# EAGLE design ioboard (EAGLE 9.6.2)
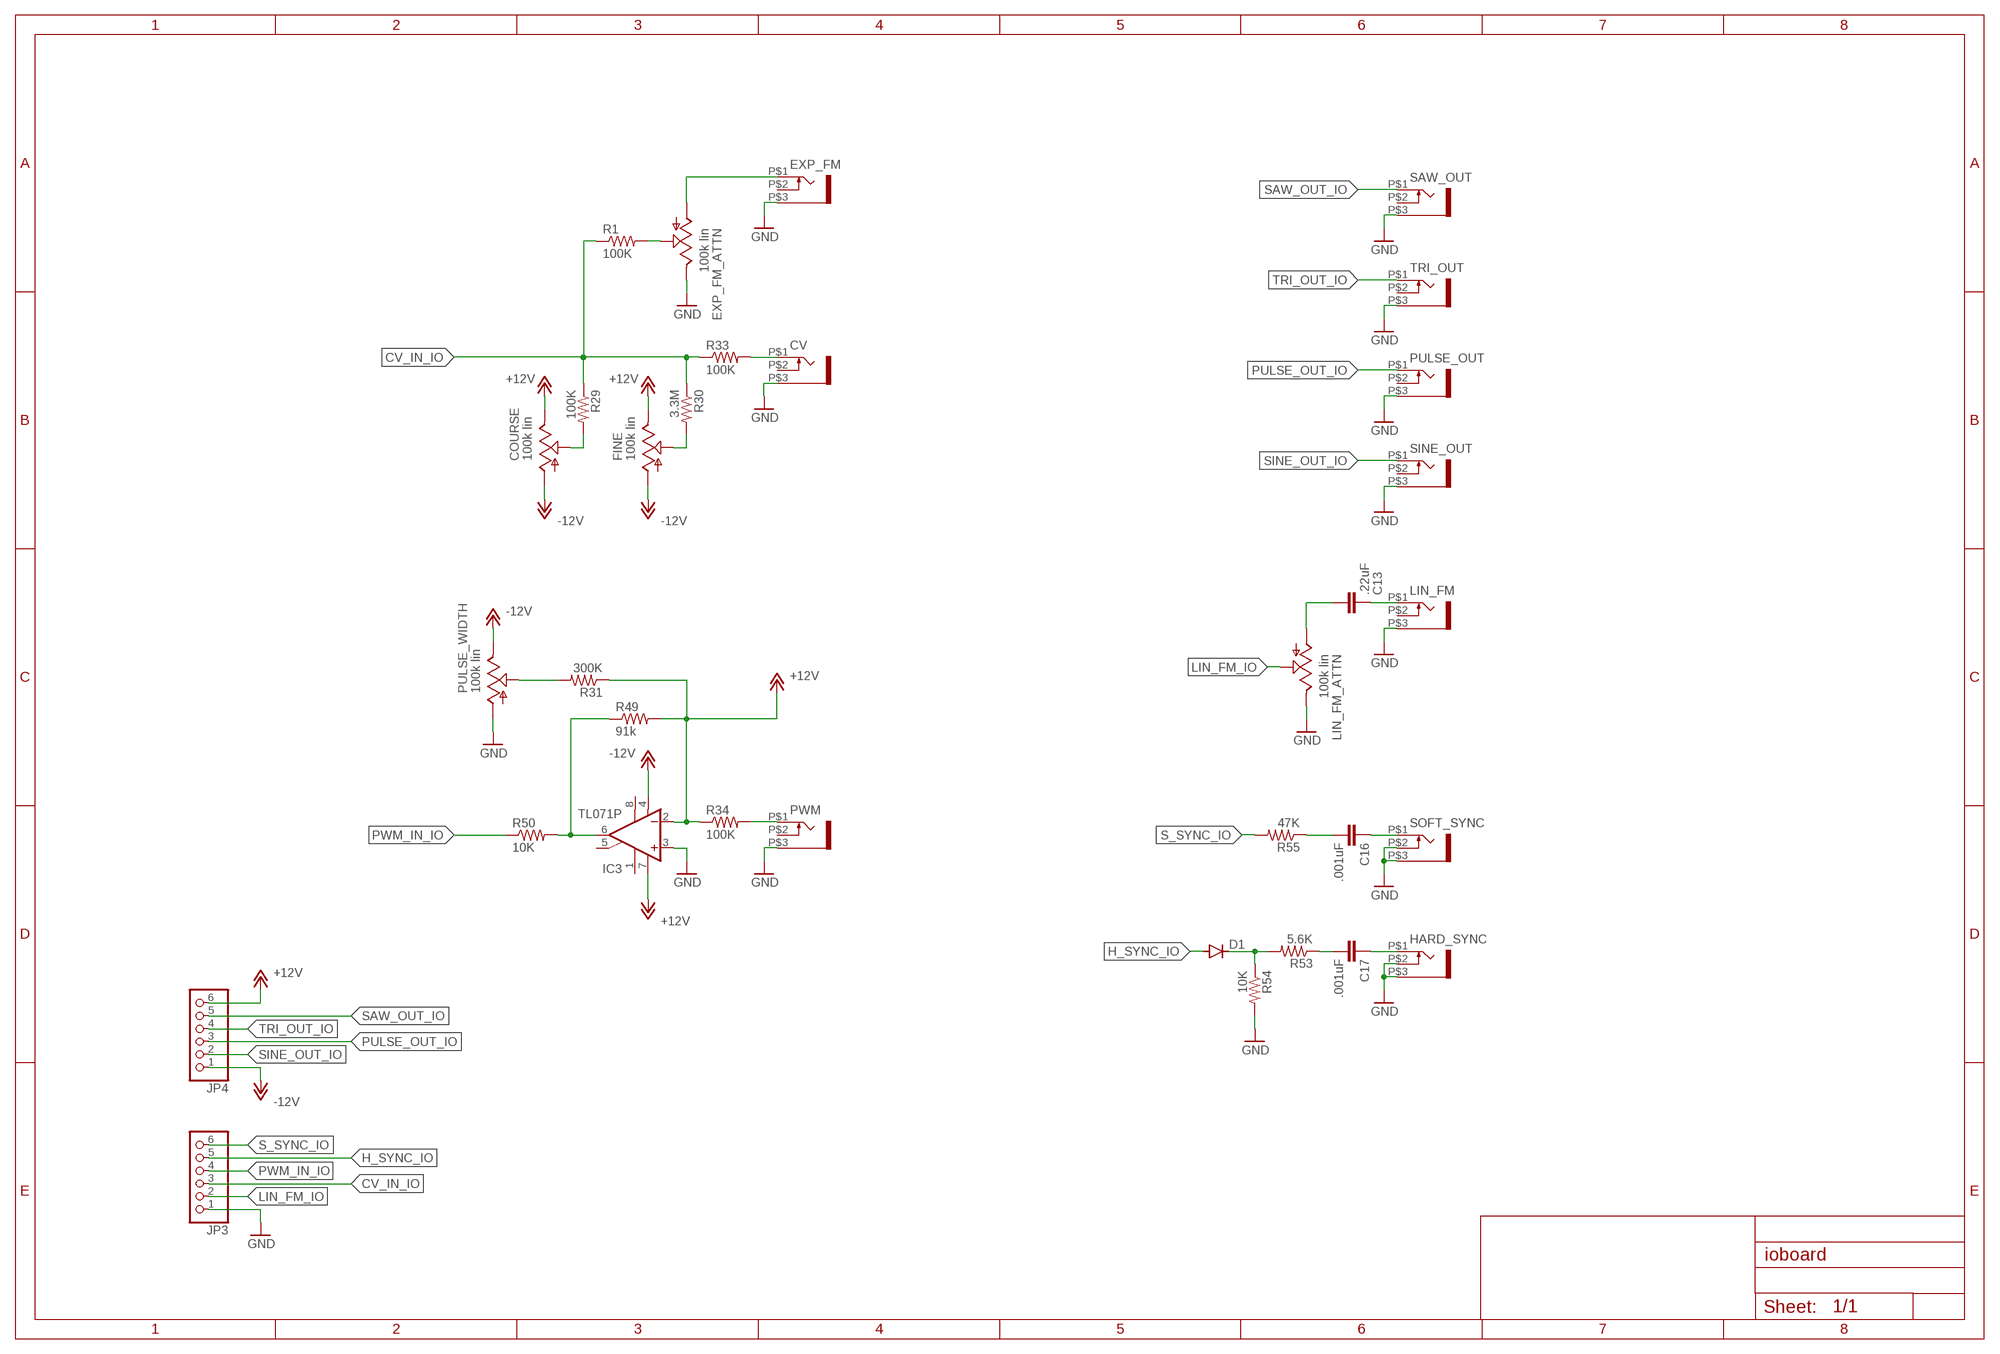
[diagram p0: schematic, sheet 1]

## Parts
C13  .22uF  C-EU050-024X044  [C050-024X044]
C16  .001uF  C-EU050-024X044  [C050-024X044]
C17  .001uF  C-EU050-024X044  [C050-024X044]
COURSE  100k lin  ALPHA-9MMA  [EVUF]
CV  WQP-PJ301M-12_JACK  [WQP-PJ301M-12_JACK]
D1  1N4148DO35-7  [DO35-7]
EXP_FM  WQP-PJ301M-12_JACK  [WQP-PJ301M-12_JACK]
EXP_FM_ATTN  100k lin  ALPHA-9MMA  [EVUF]
FINE  100k lin  ALPHA-9MMA  [EVUF]
HARD_SYNC  WQP-PJ301M-12_JACK  [WQP-PJ301M-12_JACK]
IC3  TL071P  [DIL08]
JP3  PINHD-1X6  [1X06]
JP4  PINHD-1X6  [1X06]
LIN_FM  WQP-PJ301M-12_JACK  [WQP-PJ301M-12_JACK]
LIN_FM_ATTN  100k lin  ALPHA-9MMA  [EVUF]
PULSE_OUT  WQP-PJ301M-12_JACK  [WQP-PJ301M-12_JACK]
PULSE_WIDTH  100k lin  ALPHA-9MMA  [EVUF]
PWM  WQP-PJ301M-12_JACK  [WQP-PJ301M-12_JACK]
R1  100K  R-US_0207/7  [0207/7]
R29  100K  R-US_0207/7  [0207/7]
R30  3.3M  R-US_0207/7  [0207/7]
R31  300K  R-US_0207/7  [0207/7]
R33  100K  R-US_0207/7  [0207/7]
R34  100K  R-US_0207/7  [0207/7]
R49  91k  R-US_0207/7  [0207/7]
R50  10K  R-US_0207/7  [0207/7]
R53  5.6K  R-US_0207/7  [0207/7]
R54  10K  R-US_0207/7  [0207/7]
R55  47K  R-US_0207/7  [0207/7]
SAW_OUT  WQP-PJ301M-12_JACK  [WQP-PJ301M-12_JACK]
SINE_OUT  WQP-PJ301M-12_JACK  [WQP-PJ301M-12_JACK]
SOFT_SYNC  WQP-PJ301M-12_JACK  [WQP-PJ301M-12_JACK]
TRI_OUT  WQP-PJ301M-12_JACK  [WQP-PJ301M-12_JACK]

## Nets
+12V: COURSE.3(E) FINE.3(E) IC3.2(-IN) IC3.7(V+) JP4.6 R31.1 R34.1 R49.2
-12V: COURSE.1(A) FINE.1(A) IC3.4(V-) JP4.1 PULSE_WIDTH.3(E)
CV_IN_IO: JP3.3 R1.1 R29.1 R30.1 R33.1
GND: CV.P$3 EXP_FM.P$3 EXP_FM_ATTN.3(E) HARD_SYNC.P$2 HARD_SYNC.P$3 IC3.3(+IN) JP3.1 LIN_FM.P$3 LIN_FM_ATTN.3(E) PULSE_OUT.P$3 PULSE_WIDTH.1(A) PWM.P$3 R54.2 SAW_OUT.P$3 SINE_OUT.P$3 SOFT_SYNC.P$2 SOFT_SYNC.P$3 TRI_OUT.P$3
H_SYNC_IO: D1.A JP3.5
LIN_FM_IO: EXP_FM_ATTN.2(S) JP3.2 LIN_FM_ATTN.2(S) R1.2
N$1: EXP_FM.P$1 EXP_FM_ATTN.1(A)
N$25: COURSE.2(S) R29.2
N$26: FINE.2(S) R30.2
N$27: CV.P$1 R33.2
N$35: PWM.P$1 R34.2
N$37: PULSE_WIDTH.2(S) R31.2
N$41: C13.2 LIN_FM.P$1
N$42: C13.1 LIN_FM_ATTN.1(A)
N$43: C16.1 SOFT_SYNC.P$1
N$44: IC3.6(OUT) R49.1 R50.2
N$45: C16.2 R55.1
N$46: C17.1 HARD_SYNC.P$1
N$47: C17.2 R53.1
N$48: D1.C R53.2 R54.1
PULSE_OUT_IO: JP4.3 PULSE_OUT.P$1
PWM_IN_IO: JP3.4 R50.1
S_SYNC_IO: JP3.6 R55.2
SAW_OUT_IO: JP4.5 SAW_OUT.P$1
SINE_OUT_IO: JP4.2 SINE_OUT.P$1
TRI_OUT_IO: JP4.4 TRI_OUT.P$1
Unconnected: CV.P$2 EXP_FM.P$2 IC3.1(ON1) IC3.5(ON2) IC3.8(OPT) LIN_FM.P$2 PULSE_OUT.P$2 PWM.P$2 SAW_OUT.P$2 SINE_OUT.P$2 TRI_OUT.P$2

## Library data of the parts
C13 C16 C17 = resistor:C-EU: CAPACITOR, European symbol
COURSE EXP_FM_ATTN FINE LIN_FM_ATTN PULSE_WIDTH = TomW:ALPHA-9MM: 9 mm Square Rotary Potentiometers Source: Panasonic
CV EXP_FM HARD_SYNC LIN_FM PULSE_OUT PWM SAW_OUT SINE_OUT SOFT_SYNC TRI_OUT = thonkiconn:WQP-PJ301M-12_JACK
D1 = diode:1N4148: DIODE high speed (Philips)
IC3 = linear:TL071: OP AMP
JP3 JP4 = pinhead:PINHD-1X6: PIN HEADER
R1 R29-R31 R33 R34 R49 R50 R53-R55 = resistor:R-US_: RESISTOR, American symbol

## Board
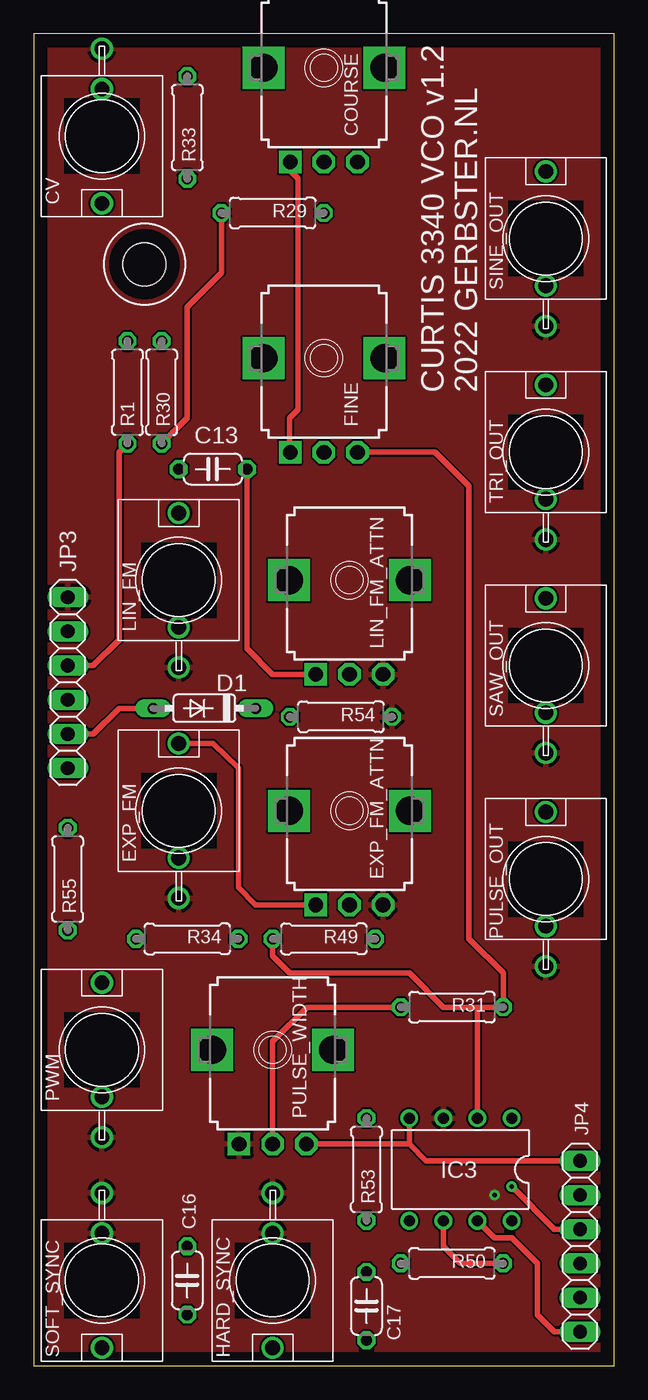
[diagram p1: board, top side]
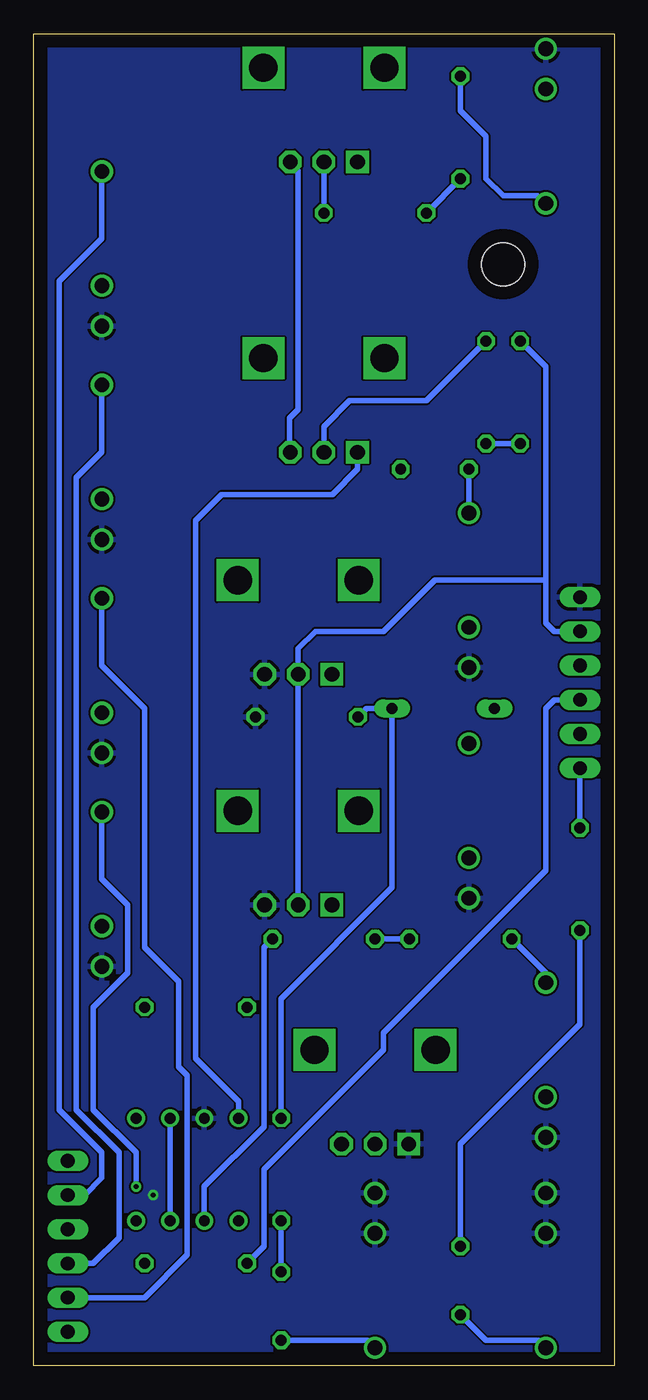
[diagram p2: board, bottom side, seen from below]

Size 43.18 x 99.06 mm. Coordinates in mm from the lower left corner, seen from the top.
Outline: 43.18,0 43.18,99.06 0,99.06 0,0 43.18,0
Copper layers (1*16): Top 0.035mm / dielectric 1.5mm / Bottom 0.035mm
Design rules "default": minimum track width 6mil, minimum drill 0.35mm, track to track 6mil, track to pad 6mil, pad to pad 6mil, via to via 6mil, smd to smd 6mil, copper to edge 40mil, drill to drill 6mil, minimum pad ring 10mil, minimum via ring 8mil, stop-mask expansion 4mil, vias tented up to drill 0mil, thermal gap 10mil
Holes 3.2 mm at 8.26,81.92

### Footprints (pad centres in the part's own frame; a part is rotated, then mirrored left to right if it is on the bottom)
C050-024X044 = drill 0.813 octagon: 1 -2.54,0; 2 2.54,0
EVUF = drill 1.1 pad 1.676 square: 1 -2.5,-7 | drill 1.1 pad 1.676 octagon: 2 0,-7; 3 2.5,-7 | drill 2.1 pad 2.8 square: M1 4.5,0; M2 -4.5,0
WQP-PJ301M-12_JACK = drill 1.1: P$1 0,5; P$2 0,-3.5; P$3 0,-6.5
DO35-7 = drill 0.813 long: A 3.81,0; C -3.81,0
DIL08 = drill 0.813 pad 1.27: 1 -3.81,-3.81; 2 -1.27,-3.81; 3 1.27,-3.81; 4 3.81,-3.81; 5 3.81,3.81; 6 1.27,3.81; 7 -1.27,3.81; 8 -3.81,3.81
1X06 = drill 1.016 long: 1 -6.35,0; 2 -3.81,0; 3 -1.27,0; 4 1.27,0; 5 3.81,0; 6 6.35,0
0207/7 = drill 0.813 octagon: 1 -3.81,0; 2 3.81,0

### Placement (x,y rotation side)
C13  13.34,66.67 180 top
C16  11.43,6.35 90 top
C17  24.77,4.45 90 top
COURSE  21.59,96.52 0 top
CV  5.08,91.44 180 top
D1  12.7,48.9 180 top
EXP_FM  10.79,41.27 0 top
EXP_FM_ATTN  23.5,41.27 0 top
FINE  21.59,74.93 0 top
HARD_SYNC  17.78,6.35 180 top
IC3  31.75,14.61 180 top
JP3  2.54,50.8 270 top
JP4  40.64,8.89 270 top
LIN_FM  10.79,58.42 0 top
LIN_FM_ATTN  23.5,58.42 0 top
PULSE_OUT  38.1,36.2 0 top
PULSE_WIDTH  17.78,23.5 0 top
PWM  5.08,23.5 0 top
R1  6.99,72.39 90 top
R29  17.78,85.72 0 top
R30  9.53,72.39 90 top
R31  31.11,26.67 180 top
R33  11.43,92.08 90 top
R34  11.43,31.75 180 top
R49  21.59,31.75 180 top
R50  31.11,7.62 0 top
R53  24.77,14.61 90 top
R54  22.86,48.26 0 top
R55  2.54,36.2 90 top
SAW_OUT  38.1,52.07 0 top
SINE_OUT  38.1,83.82 0 top
SOFT_SYNC  5.08,6.35 180 top
TRI_OUT  38.1,67.94 0 top

### Tracks (layer width: path | path; a pad name or v marks a point on that pad's centre or on a via)
+12V  (via drill 0.35)
  Top 0.406: IC3.7 34.29,9.53 35.56,9.53 37.47,7.62 37.47,3.81 38.73,2.54 JP4.6 | FINE.3 v24.13,67.93 v24.13,67.94 29.84,67.94 32.38,65.41 32.38,31.75 34.92,29.21 R31.1 33.02,26.67 | 33.02,26.67 30.48,26.67 27.94,29.21 19.05,29.21 17.78,30.48 R49.2 | IC3.2 33.02,26.67
  Bottom 0.406: IC3.7 IC3.2 | COURSE.3 23.5,88.89 23.5,71.12 24.13,70.48 v24.13,67.94 | R49.2 R34.1
-12V
  Top 0.406: 27.94,16.51 PULSE_WIDTH.3 | IC3.4 27.94,16.51 | COURSE.1 19.09,88.9 19.05,88.9 19.68,88.27 19.68,71.12 19.05,70.48 19.05,67.93 FINE.1 | JP4.1 29.17,15.24 27.94,16.51
  Bottom 0.406: FINE.1 19.09,66.67 20.95,64.77 29.21,64.77 31.11,62.87 31.11,22.86 27.94,19.68 IC3.4
CV_IN_IO
  Top 0.406: R30.1 11.43,70.48 11.43,78.74 13.97,81.28 R29.1 | JP3.3 4.45,52.07 6.35,53.98 6.35,67.94 R1.1
  Bottom 0.406: R33.1 R29.1 | R1.1 R30.1
GND  (via drill 0.35)
  other vias: 34.29,12.7
  pour Top: 0,0 43.18,0 43.18,99.06 0,99.06
  pour Bottom: 0,0 43.18,0 43.18,99.06 0,99.06
H_SYNC_IO
  Top 0.406: JP3.5 4.45,46.99 6.35,48.9 D1.A
LIN_FM_IO
  Bottom 0.406: 5.08,58.42 5.08,55.24 4.45,54.61 JP3.2 | 5.08,58.42 5.08,74.3 R1.2 | EXP_FM_ATTN.2 LIN_FM_ATTN.2 23.5,53.34 22.23,54.61 17.14,54.61 13.34,58.42 5.08,58.42
N$1
  Top 0.406: EXP_FM.P$1 13.34,46.27 15.24,44.45 15.24,35.56 16.51,34.29 21.63,34.29 EXP_FM_ATTN.1
N$25
  Bottom 0.406: COURSE.2 R29.2
N$26
  Bottom 0.406: FINE.2 21.59,69.85 19.68,71.75 13.97,71.75 R30.2
N$27
  Bottom 0.406: R33.2 11.43,93.34 9.53,91.44 9.53,88.27 8.26,87 5.71,87 CV.P$1
N$35
  Bottom 0.406: PWM.P$1 5.08,29.21 R34.2
N$37
  Top 0.406: R31.2 20.32,26.67 17.78,24.13 PULSE_WIDTH.2
N$41
  Bottom 0.406: LIN_FM.P$1 C13.2
N$42
  Top 0.406: C13.1 15.88,53.34 17.78,51.42 LIN_FM_ATTN.1
N$43
  Bottom 0.406: SOFT_SYNC.P$1 5.63,1.91 9.53,1.91 C16.1
N$44
  Top 0.406: IC3.6 30.48,8.89 31.75,7.62 R50.2
  Bottom 0.406: R49.1 26.04,31.11 26.04,17.78 30.48,13.34 IC3.6
N$45
  Bottom 0.406: C16.2 11.43,16.51 2.54,25.4 R55.1
N$46
  Bottom 0.406: HARD_SYNC.P$1 18.34,1.91 C17.1
N$47
  Bottom 0.406: R53.1 C17.2
N$48
  Bottom 0.406: R54.1 18.41,48.9 D1.C 16.51,35.56 24.77,27.3 R53.2
PULSE_OUT_IO  (via drill 0.35)
  Top 0.406: v35.56,13.34 38.73,10.16 JP4.3
  Bottom 0.406: PULSE_OUT.P$1 38.1,36.2 36.2,34.29 36.18,34.13 36.2,29.21 38.73,26.67 38.73,19.05 35.56,15.88 v35.56,13.34
PWM_IN_IO
  Bottom 0.406: JP3.4 4.45,49.53 5.08,48.9 5.08,36.83 17.14,24.77 17.14,23.5 26.04,14.61 26.04,8.89 R50.1
S_SYNC_IO
  Bottom 0.406: R55.2 JP3.6
SAW_OUT_IO
  Bottom 0.406: SAW_OUT.P$1 38.1,52.07 34.92,48.9 34.92,31.11 32.38,28.57 32.38,22.23 31.75,21.59 31.75,8.26 34.92,5.08 JP4.5
SINE_OUT_IO
  Bottom 0.406: SINE_OUT.P$1 38.1,83.82 41.27,80.64 41.27,19.05 38.1,15.88 38.1,13.97 39.37,12.7 JP4.2
TRI_OUT_IO
  Bottom 0.406: TRI_OUT.P$1 38.1,67.94 40.01,66.04 40.01,19.05 36.83,15.88 36.83,9.53 38.73,7.62 JP4.4

### Text on the board
tNames: CURTIS 3340 VCO v1.2 / 2022 GERBSTER.NL